# EAGLE schematic KickerBoard (EAGLE 7.4.0)
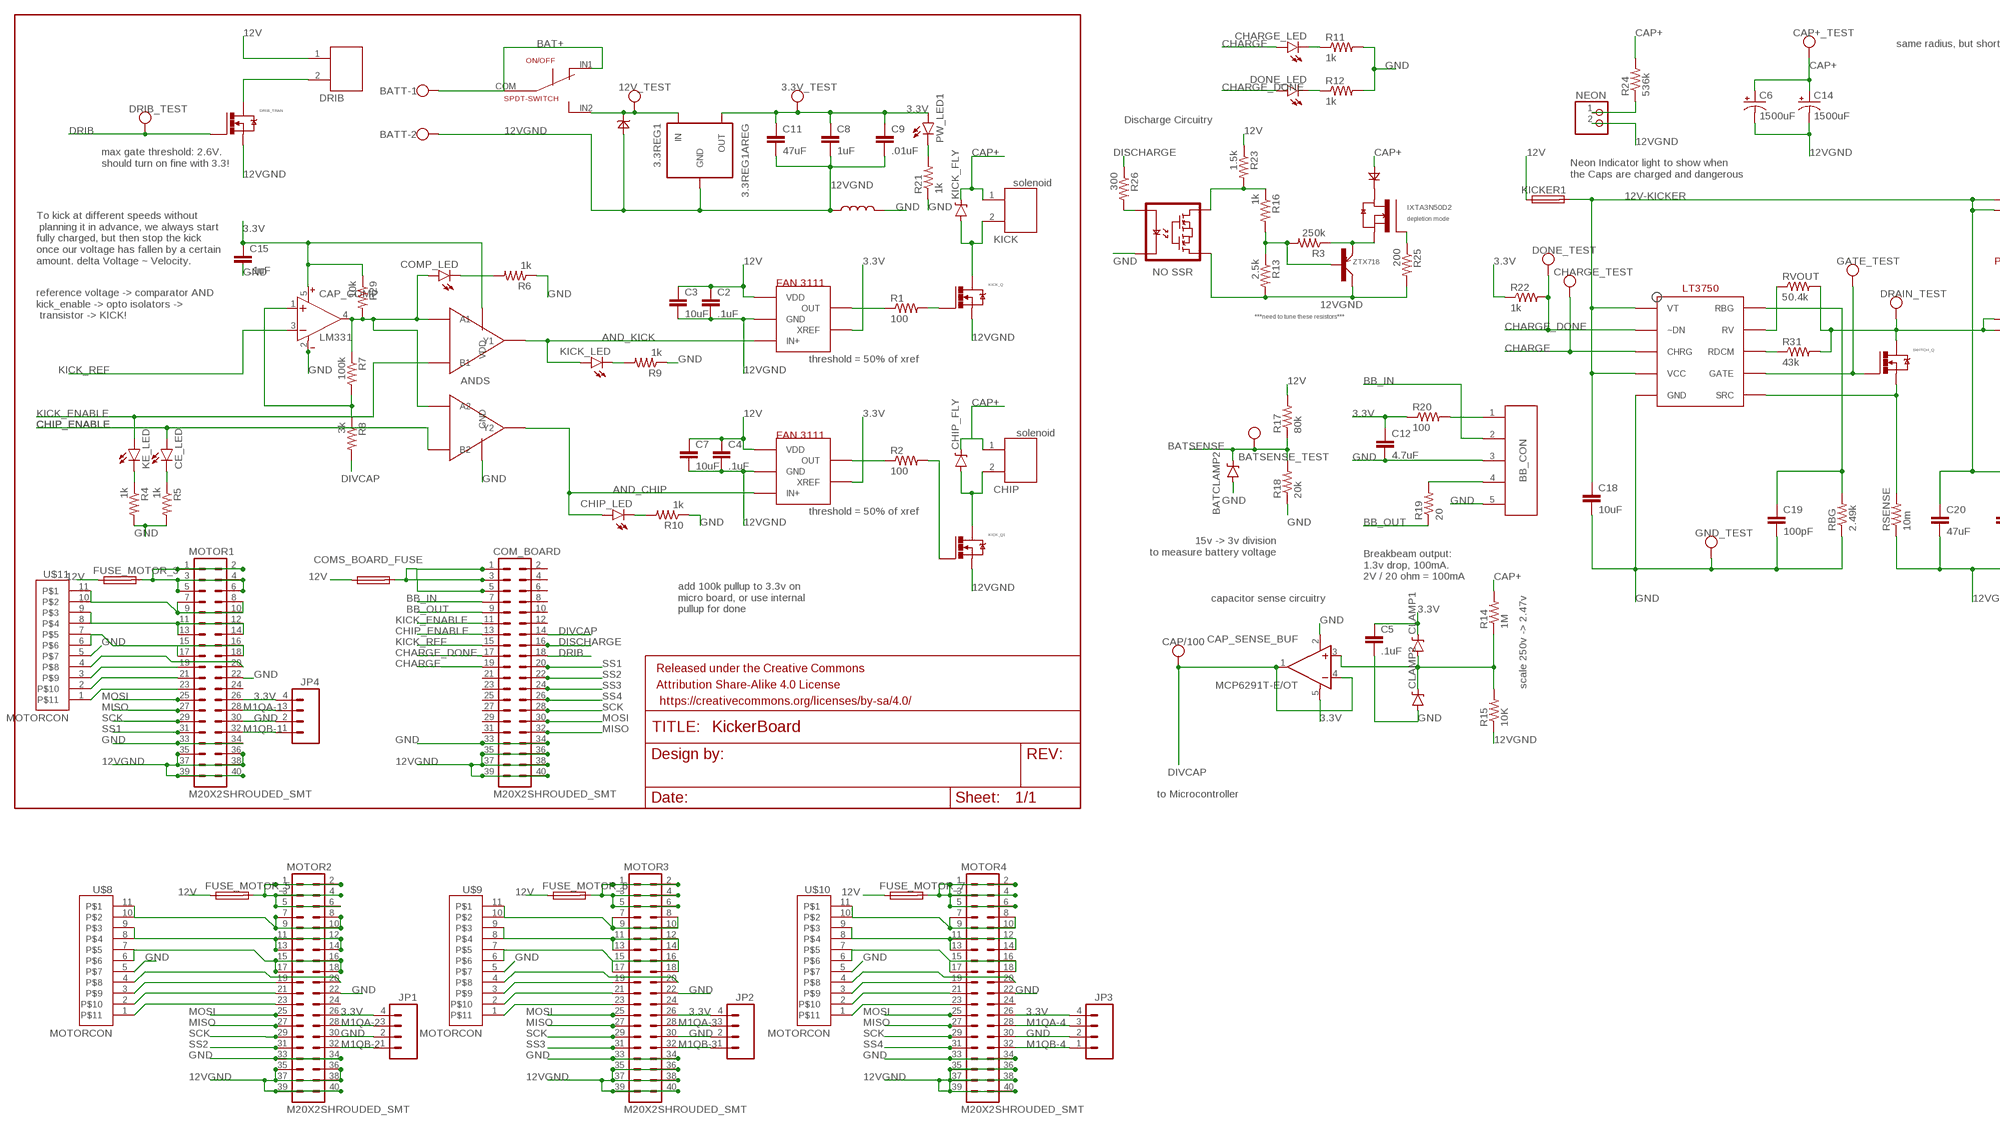
[diagram p0: schematic, sheet 1, part 1 of 3]
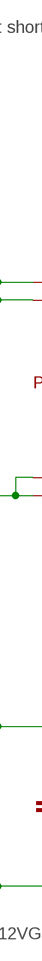
[diagram p1: schematic, sheet 1, part 2 of 3]
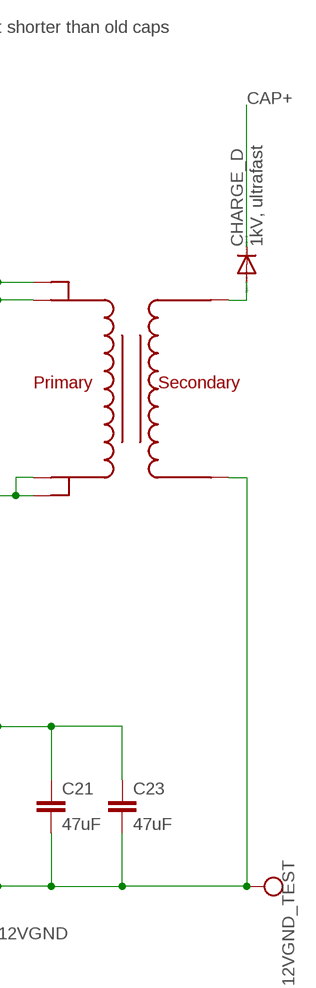
[diagram p2: schematic, sheet 1, part 3 of 3]

## Parts
3.3REG1  3.3REG1AREG  [DPAK]
3.3V_TEST  TEST_PT  [TESTING_PT]
12V_TEST  TEST_PT  [TESTING_PT]
12VGND_TEST  TEST_PT  [TESTING_PT]
ANDS  AND-DUAL  [TSSOP8]
BATCLAMP2  DIODE-ZENERDO214AC  [DO214AC]
BATSENSE_TEST  TEST_PT  [TESTING_PT]
BATT  W237-102  [W237-102]
BB_CON  JST-5  [JST-5-2MM]
C2  .1uF  CAP1206  [1206]
C3  10uF  CAP1206  [1206]
C4  .1uF  CAP1206  [1206]
C5  .1uF  CAP0805  [0805]
C6  1500uF  CPOL-USE10-35  [EB35D]
C7  10uF  CAP1206  [1206]
C8  1uF  CAP0805  [0805]
C9  .01uF  CAP0805  [0805]
C11  47uF  CAP1206  [1206]
C12  4.7uF  CAP0805  [0805]
C14  1500uF  CPOL-USE10-35  [EB35D]
C15  .1uF  CAP0805  [0805]
C18  10uF  CAP0805  [0805]
C19  100pF  CAP0805  [0805]
C20  47uF  CAP1206  [1206]
C21  47uF  CAP1206  [1206]
C23  47uF  CAP1206  [1206]
CAP+_TEST  TEST_PT  [TESTING_PT]
CAP/100  TEST_PT  [TESTING_PT]
CAP_COMP  LM331  [SOT23-5]
CAP_SENSE_BUF  MCP6291T-E/OT  [SOT23-5]
CE_LED  LED1206  [LED-1206]
CHARGE_D  1kV, ultrafast  DIODE-DO214AC  [DO214AC]
CHARGE_LED  LED1206  [LED-1206]
CHARGE_TEST  TEST_PT  [TESTING_PT]
CHARGE_U  LT3750  [10-MSOP]
CHIP  JST-22MM  [JST-2-2MM]
CHIP_FLY  DIODE-ZENERDO214AB  [DO214AB]
CHIP_LED  LED1206  [LED-1206]
CLAMP1  DIODE-ZENERDO214AC  [DO214AC]
CLAMP2  DIODE-ZENERDO214AC  [DO214AC]
COM_BOARD  M20X2SHROUDED_SMT  [2X20_SHROUDED_SMT]
COMP_LED  LED1206  [LED-1206]
COMS_BOARD_FUSE  TR5  [TR5]
DONE_LED  LED1206  [LED-1206]
DONE_TEST  TEST_PT  [TESTING_PT]
DRAIN_TEST  TEST_PT  [TESTING_PT]
DRIB  JST-22MM  [JST-2-2MM]
DRIB_TEST  TEST_PT  [TESTING_PT]
DRIB_TRAN  N-MOSFETDPAK  [DPAK]
FRAME4  FRAME-LETTER  [CREATIVE_COMMONS]
FUSE_MOTOR_3  TR5  [TR5]
FUSE_MOTOR_5  TR5  [TR5]
FUSE_MOTOR_6  TR5  [TR5]
FUSE_MOTOR_7  TR5  [TR5]
GATE_TEST  TEST_PT  [TESTING_PT]
GND_TEST  TEST_PT  [TESTING_PT]
JP1  M04SMD_RA_FEMALE  [1X04_SMD_RA_FEMALE]
JP2  M04SMD_RA_FEMALE  [1X04_SMD_RA_FEMALE]
JP3  M04SMD_RA_FEMALE  [1X04_SMD_RA_FEMALE]
JP4  M04SMD_RA_FEMALE  [1X04_SMD_RA_FEMALE]
KE_LED  LED1206  [LED-1206]
KICK  JST-22MM  [JST-2-2MM]
KICK_FLY  DIODE-ZENERDO214AB  [DO214AB]
KICK_LED  LED1206  [LED-1206]
KICK_Q  N-MOSFETDPAK  [DPAK]
KICK_Q1  N-MOSFETDPAK  [DPAK]
KICKER1  TR5  [TR5]
MOTOR1  M20X2SHROUDED_SMT  [2X20_SHROUDED_SMT]
MOTOR2  M20X2SHROUDED_SMT  [2X20_SHROUDED_SMT]
MOTOR3  M20X2SHROUDED_SMT  [2X20_SHROUDED_SMT]
MOTOR4  M20X2SHROUDED_SMT  [2X20_SHROUDED_SMT]
NEON  PINHD-1X2  [1X02]
ON/OFF  SPDT-SWITCH  [CK_SWITCH]
PW_LED1  LED1206  [LED-1206]
R1  100  RESISTOR0805-RES  [0805]
R2  100  RESISTOR0805-RES  [0805]
R3  250k  RESISTOR0805-RES  [0805]
R4  1k  RESISTOR0805-RES  [0805]
R5  1k  RESISTOR0805-RES  [0805]
R6  1k  RESISTOR0805-RES  [0805]
R7  100k  RESISTOR0805-RES  [0805]
R8  3k  RESISTOR0805-RES  [0805]
R9  1k  RESISTOR0805-RES  [0805]
R10  1k  RESISTOR0805-RES  [0805]
R11  1k  RESISTOR0805-RES  [0805]
R12  1k  RESISTOR0805-RES  [0805]
R13  2.5k  RESISTOR0805-RES  [0805]
R14  1M  RESISTOR0805-RES  [0805]
R15  10K  RESISTOR0805-RES  [0805]
R16  1k  RESISTOR0805-RES  [0805]
R17  80k  RESISTOR0805-RES  [0805]
R18  20k  RESISTOR0805-RES  [0805]
R19  20  RESISTOR0805-RES  [0805]
R20  100  RESISTOR0805-RES  [0805]
R21  1k  RESISTOR0805-RES  [0805]
R22  1k  RESISTOR0805-RES  [0805]
R23  1.5k  RESISTOR0805-RES  [0805]
R24  536k  RESISTOR0805-RES  [0805]
R25  200  RESISTOR0805-RES  [0805]
R26  300  RESISTOR0805-RES  [0805]
R29  10k  RESISTOR0805-RES  [0805]
R31  43k  RESISTOR0805-RES  [0805]
RBG  2.49k  RESISTOR0805-RES  [0805]
RSENSE  10m  RESISTOR2512  [R2512]
RVOUT  50.4k  RESISTOR0805-RES  [0805]
SWITCH_Q  N-MOSFETDPAK  [DPAK]
U$1  FAN31111  [SOT23-5]
U$2  IXTA3N50D2  [TO-263]
U$3  32052-TRANSFORMER  [10-TRANSFORMER]
U$4  FAN31111  [SOT23-5]
U$5  VO1400AEFTR  [SOP4]
U$6  ZTX718  [TO92]
U$7  1N4007  [THROUGH-HOLE-2]
U$8  MOTORCON  [GEN3CON]
U$9  MOTORCON  [GEN3CON]
U$10  MOTORCON  [GEN3CON]
U$11  MOTORCON  [GEN3CON]
U$12  13VZENER  [THROUGH-HOLE-2]
U$13  INDUCTOR  [0805]

## Nets
3.3V: 3.3REG1.SOURCE(OUT) 3.3V_TEST.P$1 ANDS.P$8(VDD) C5.1 C8.1 C9.1 C11.1 C12.1 C15.1 CAP_COMP.5(V+) CAP_SENSE_BUF.5(V+) CLAMP1.C JP1.4 JP2.4 JP3.4 JP4.4 MOTOR1.26 MOTOR2.26 MOTOR3.26 MOTOR4.26 PW_LED1.A R20.1 R22.1 R29.1 U$1.4(XREF) U$4.4(XREF)
12V: 3.3REG1.GATE(IN) 12V_TEST.P$1 C2.1 C3.1 C4.1 C7.1 COMS_BOARD_FUSE.1 DRIB.1 FUSE_MOTOR_3.1 FUSE_MOTOR_5.1 FUSE_MOTOR_6.1 FUSE_MOTOR_7.1 KICKER1.1 ON/OFF.IN2(P2) R17.2 R23.1 U$1.1(VDD) U$4.1(VDD) U$12.-
12V-KICKER: C18.1 C20.1 C21.1 C23.1 CHARGE_U.P$1(VT) CHARGE_U.P$4(VCC) KICKER1.2 U$3.P$4 U$3.P$5
12VGND: 3.3REG1.DRAIN(GND) 12VGND_TEST.P$1 BATT.2 C2.2 C3.2 C4.2 C6.- C7.2 C8.2 C9.2 C11.2 C14.- C20.2 C21.2 C23.2 COM_BOARD.35 COM_BOARD.36 COM_BOARD.37 COM_BOARD.38 COM_BOARD.39 COM_BOARD.40 DRIB_TRAN.SOURCE(S) KICK_Q1.SOURCE(S) KICK_Q.SOURCE(S) MOTOR1.35 MOTOR1.36 MOTOR1.37 MOTOR1.38 MOTOR1.39 MOTOR1.40 MOTOR2.35 MOTOR2.36 MOTOR2.37 MOTOR2.38 MOTOR2.39 MOTOR2.40 MOTOR3.35 MOTOR3.36 MOTOR3.37 MOTOR3.38 MOTOR3.39 MOTOR3.40 MOTOR4.35 MOTOR4.36 MOTOR4.37 MOTOR4.38 MOTOR4.39 MOTOR4.40 NEON.2 R13.2 R15.1 R25.2 RSENSE.1 U$1.2(GND) U$3.P$10 U$4.2(GND) U$5.3(S2) U$6.LEFT(COLLECTOR) U$12.+ U$13.1
AND_CHIP: ANDS.P$3(Y2) CHIP_LED.A U$1.3(IN+)
AND_KICK: ANDS.P$7(Y1) KICK_LED.A U$4.3(IN+)
BAT+: BATT.1 ON/OFF.COM ON/OFF.IN1(P1)
BATSENSE: BATCLAMP2.C BATSENSE_TEST.P$1 R17.1 R18.2
BB_IN: BB_CON.2 COM_BOARD.7
BB_OUT: COM_BOARD.9 R19.1
CAP+: C6.+ C14.+ CAP+_TEST.P$1 CHARGE_D.C CHIP.1 CHIP_FLY.CATHODE(C) KICK.1 KICK_FLY.CATHODE(C) R14.2 R24.2 U$7.+(D+)
CHARGE: CHARGE_LED.A CHARGE_TEST.P$1 CHARGE_U.P$3(CHRG) COM_BOARD.19
CHARGE_DONE: CHARGE_U.P$2(~DN) COM_BOARD.17 DONE_LED.A DONE_TEST.P$1 R22.2
CHIP_ENABLE: ANDS.P$6(B2) CE_LED.A COM_BOARD.13
COMP_OUT: ANDS.P$1(A1) ANDS.P$5(A2) CAP_COMP.4(OUT) COMP_LED.A R7.1 R29.2
DISCHARGE: COM_BOARD.16 R26.1
DIVCAP: CAP/100.P$1 CAP_SENSE_BUF.1(OUT) CAP_SENSE_BUF.4(-IN) COM_BOARD.14 R8.2
DRIB: COM_BOARD.18 DRIB_TEST.P$1 DRIB_TRAN.GATE(G)
GND: ANDS.P$4(GND) BATCLAMP2.A BB_CON.3 BB_CON.5 C5.2 C12.2 C15.2 C18.2 C19.2 CAP_COMP.2(V-) CAP_SENSE_BUF.2(V-) CHARGE_U.P$5(GND) CLAMP2.A COM_BOARD.33 COM_BOARD.34 GND_TEST.P$1 JP1.2 JP2.2 JP3.2 JP4.2 MOTOR1.22 MOTOR1.30 MOTOR1.33 MOTOR1.34 MOTOR2.22 MOTOR2.30 MOTOR2.33 MOTOR2.34 MOTOR3.22 MOTOR3.30 MOTOR3.33 MOTOR3.34 MOTOR4.22 MOTOR4.30 MOTOR4.33 MOTOR4.34 R4.2 R5.2 R6.1 R9.1 R10.1 R11.2 R12.2 R18.1 R21.1 RBG.1 U$5.2(LED-) U$8.5 U$9.5 U$10.5 U$11.5 U$13.2
HYSTERESIS: CAP_COMP.1(IN+) R7.2 R8.1
KICK_ENABLE: ANDS.P$2(B1) COM_BOARD.11 KE_LED.A
KICK_REF: CAP_COMP.3(IN-) COM_BOARD.15
LOWCHIP: CHIP.2 CHIP_FLY.ANODE(A) KICK_Q1.DRAIN(D)
LOWKICK: KICK.2 KICK_FLY.ANODE(A) KICK_Q.DRAIN(D)
M1QA-1: JP4.3 MOTOR1.28
M1QA-2: JP1.3 MOTOR2.28
M1QA-3: JP2.3 MOTOR3.28
M1QA-4: JP3.3 MOTOR4.28
M1QB-1: JP4.1 MOTOR1.32
M1QB-2: JP1.1 MOTOR2.32
M1QB-3: JP2.1 MOTOR3.32
M1QB-4: JP3.1 MOTOR4.32
MISO: COM_BOARD.32 MOTOR1.27 MOTOR2.27 MOTOR3.27 MOTOR4.27
MOSI: COM_BOARD.30 MOTOR1.25 MOTOR2.25 MOTOR3.25 MOTOR4.25
N$1: DRAIN_TEST.P$1 R31.2 RVOUT.2 SWITCH_Q.DRAIN(D) U$3.P$6 U$3.P$7
N$2: R1.1 U$4.5(OUT)
N$3: KICK_Q1.GATE(G) R2.2
N$4: FUSE_MOTOR_6.2 MOTOR3.1 MOTOR3.2 MOTOR3.3 MOTOR3.4 MOTOR3.5 MOTOR3.6
N$5: R2.1 U$1.5(OUT)
N$6: CHARGE_U.P$8(RDCM) R31.1
N$7: C19.1 CHARGE_U.P$10(RBG) RBG.2
N$8: KICK_Q.GATE(G) R1.2
N$9: CHARGE_U.P$7(GATE) GATE_TEST.P$1 SWITCH_Q.GATE(G)
N$10: R3.1 U$2.LOWER_RIGHT(SOURCE) U$6.RIGHT(EMITTER)
N$11: KE_LED.C R4.1
N$12: CHARGE_U.P$9(RV) RVOUT.1
N$13: CE_LED.C R5.1
N$14: COMP_LED.C R6.2
N$15: KICK_LED.C R9.2
N$17: CHIP_LED.C R10.2
N$18: R3.2 R13.1 R16.2 U$6.CENTER(BASE)
N$19: DONE_LED.C R12.1
N$20: CHARGE_LED.C R11.1
N$21: R25.1 U$2.LOWER_LEFT(GATE)
N$23: PW_LED1.C R21.2
N$24: CHARGE_U.P$6(SRC) RSENSE.2 SWITCH_Q.SOURCE(S)
N$25: FUSE_MOTOR_7.2 MOTOR4.1 MOTOR4.2 MOTOR4.3 MOTOR4.4 MOTOR4.5 MOTOR4.6
N$26: FUSE_MOTOR_5.2 MOTOR2.1 MOTOR2.2 MOTOR2.3 MOTOR2.4 MOTOR2.5 MOTOR2.6
N$27: FUSE_MOTOR_3.2 MOTOR1.1 MOTOR1.2 MOTOR1.3 MOTOR1.4 MOTOR1.5 MOTOR1.6
N$28: COM_BOARD.1 COM_BOARD.3 COM_BOARD.5 COMS_BOARD_FUSE.2
N$29: R16.1 R23.2 U$5.4(S1)
N$30: R26.2 U$5.1(LED+)
N$32: BB_CON.4 R19.2
N$36: U$2.TAB(DRAIN) U$7.-(D-)
N$37: MOTOR2.7 MOTOR2.8 MOTOR2.9 MOTOR2.10 U$8.10 U$8.11
N$38: MOTOR2.11 MOTOR2.12 MOTOR2.13 MOTOR2.14 U$8.8 U$8.9
N$39: MOTOR2.15 MOTOR2.16 MOTOR2.17 MOTOR2.18 U$8.6 U$8.7
N$40: BB_CON.1 R20.2
N$42: MOTOR2.20 U$8.4
N$43: MOTOR2.19 U$8.3
N$44: MOTOR2.21 U$8.2
N$45: MOTOR2.23 U$8.1
N$46: MOTOR1.7 MOTOR1.8 MOTOR1.9 MOTOR1.10 U$11.10 U$11.11
N$47: MOTOR1.11 MOTOR1.12 MOTOR1.13 MOTOR1.14 U$11.8 U$11.9
N$48: MOTOR1.15 MOTOR1.16 MOTOR1.17 MOTOR1.18 U$11.6 U$11.7
N$50: MOTOR1.20 U$11.4
N$51: MOTOR1.19 U$11.3
N$52: MOTOR1.21 U$11.2
N$53: MOTOR1.23 U$11.1
N$54: MOTOR3.7 MOTOR3.8 MOTOR3.9 MOTOR3.10 U$9.10 U$9.11
N$55: MOTOR3.11 MOTOR3.12 MOTOR3.13 MOTOR3.14 U$9.8 U$9.9
N$56: MOTOR3.15 MOTOR3.16 MOTOR3.17 MOTOR3.18 U$9.6 U$9.7
N$58: MOTOR3.20 U$9.4
N$59: MOTOR3.19 U$9.3
N$60: MOTOR3.21 U$9.2
N$61: MOTOR3.23 U$9.1
N$62: MOTOR4.7 MOTOR4.8 MOTOR4.9 MOTOR4.10 U$10.10 U$10.11
N$63: MOTOR4.11 MOTOR4.12 MOTOR4.13 MOTOR4.14 U$10.8 U$10.9
N$64: MOTOR4.15 MOTOR4.16 MOTOR4.17 MOTOR4.18 U$10.6 U$10.7
N$66: MOTOR4.20 U$10.4
N$67: MOTOR4.19 U$10.3
N$68: MOTOR4.21 U$10.2
N$69: MOTOR4.23 U$10.1
SCK: COM_BOARD.28 MOTOR1.29 MOTOR2.29 MOTOR3.29 MOTOR4.29
SS1: COM_BOARD.20 MOTOR1.31
SS2: COM_BOARD.22 MOTOR2.31
SS3: COM_BOARD.24 MOTOR3.31
SS4: COM_BOARD.26 MOTOR4.31
TO_DRIB: DRIB.2 DRIB_TRAN.DRAIN(D)
TO_NEON: NEON.1 R24.1
TRANS_OUT: CHARGE_D.A U$3.P$1
UNBUF_DIVCAP: CAP_SENSE_BUF.3(+IN) CLAMP1.A CLAMP2.C R14.1 R15.2
Unconnected: COM_BOARD.2 COM_BOARD.4 COM_BOARD.6 COM_BOARD.8 COM_BOARD.10 COM_BOARD.12 COM_BOARD.21 COM_BOARD.23 COM_BOARD.25 COM_BOARD.27 COM_BOARD.29 COM_BOARD.31 MOTOR1.24 MOTOR2.24 MOTOR3.24 MOTOR4.24

## Notes on the sheet
- same radius, but shorter than old caps
- Discharge Circuitry
- DISCHARGE
- max gate threshold: 2.6V. 
  should turn on fine with 3.3!
- Neon Indicator light to show when
  the Caps are charged and dangerous
- solenoid
- IXTA3N50D2
- depletion mode
- To kick at different speeds without
   planning it in advance, we always start 
  fully charged, but then stop the kick 
  once our voltage has fallen by a certain 
  amount. delta Voltage ~ Velocity.
- ZTX718
- NO SSR
- reference voltage -> comparator AND 
  kick_enable -> opto isolators ->
   transistor -> KICK!
- ***need to tune these resistors***
- threshold = 50% of xref
- solenoid
- threshold = 50% of xref
- 15v -> 3v division
  to measure battery voltage
- Breakbeam output:
  1.3v drop, 100mA.
  2V / 20 ohm = 100mA
- capacitor sense circuitry
- add 100k pullup to 3.3v on 
  micro board, or use internal 
  pullup for done
- DISCHARGE
- scale 250v -> 2.47v
- to Microcontroller

## Library data of the parts
3.3REG1 = gen3:3.3REG1A
3.3V_TEST 12V_TEST 12VGND_TEST BATSENSE_TEST CAP+_TEST CAP/100 CHARGE_TEST DONE_TEST DRAIN_TEST DRIB_TEST GATE_TEST GND_TEST = gen3:TEST_PT: Testing Point Use to probe a signal
ANDS = gen3:AND-DUAL
BATCLAMP2 CHIP_FLY CLAMP1 CLAMP2 KICK_FLY = gen3:DIODE-ZENER: Zener Diode Production Part - 8199 3.4V Zener Voltage
BATT = con-wago-500:W237-102: WAGO SCREW CLAMP; MPN: 237-102; OC_FARNELL: unknown; OC_NEWARK: 70K9898
BB_CON = gen3:JST-5
C2-C5 C7-C9 C11 C12 C15 C18-C21 C23 = SparkFun-Capacitors:CAP: Capacitor Standard 0603 ceramic capacitor, and 0.1" leaded capacitor.
C6 C14 = rcl:CPOL-US: POLARIZED CAPACITOR, American symbol
CAP_COMP = gen3:LM331: LM331 Single Comparator Digikey: 296-6633-1-ND
CAP_SENSE_BUF = SparkFun-AnalogIC:MCP6291: Rail to rail OpAmp with 10MHz GBP; PROD_ID: IC-11991
CE_LED CHARGE_LED CHIP_LED COMP_LED DONE_LED KE_LED KICK_LED PW_LED1 = SparkFun-LED:LED: LEDs Standard schematic elements and footprints for 5mm, 3mm, 1206, and 0603 sized LEDs. 5mm - Spark Fun Electronics SKU : COM-00529 (and others)
CHARGE_D = gen3:DIODE-: DIODE
CHARGE_U = kickerchips:LT3750
CHIP DRIB KICK = gen3:JST-2
COM_BOARD MOTOR1-MOTOR4 = SparkFun-Connectors:M20X2: 0.1" spaced headers
COMS_BOARD_FUSE FUSE_MOTOR_3 FUSE_MOTOR_5-FUSE_MOTOR_7 KICKER1 = fuse:TR5: FUSE Wickmann; OC_FARNELL: unknown; OC_NEWARK: unknown
DRIB_TRAN KICK_Q KICK_Q1 SWITCH_Q = gen3:N-MOSFET: N-Channel Power Mosfet
FRAME4 = SparkFun-Aesthetics:FRAME-LETTER: Schematic Frame Standard 8.5x11 US Letter frame
JP1-JP4 = SparkFun-Connectors:M04: Header 4 Standard 4-pin 0.1" header. Use with straight break away headers (SKU : PRT-00116), right angle break away headers (PRT-00553), swiss pins (PRT-00743), machine pins (PRT-00117), and female headers (PRT-00115). Molex polarized connector foot print use with SKU : PRT-08231 with associated crimp pins and housings. 1MM SMD Version SKU: PRT-10208
NEON = pinhead:PINHD-1X2: PIN HEADER
ON/OFF = gen3:SPDT-SWITCH
R1 R2 R14 R15 = SparkFun-Resistors:RESISTOR: Resistor Basic schematic elements and footprints for 0603, 1206, and PTH resistors.
R3-R13 R16-R26 R29 R31 RBG RSENSE RVOUT = SparkFun-Passives:RESISTOR: Resistor Basic schematic elements and footprints for 0603, 1206, and PTH resistors.
U$1 U$4 = kickerchips:FAN3111: FAN3111 Low Side Gate Driver, 1A. switches at 50% of xref
U$2 = rfc:IXTA3N50D2
U$3 = gen3:32052-TRANSFORMER: 32052 flyback transformer digikey #: 732-2129-1-ND
U$5 = rfc:VO1400AEFTR
U$6 = rfc:ZTX718
U$7 = rfc:1N4007
U$8-U$11 = gen3:MOTORCON: Motor Connector bottom side connector for ribbon cable
U$12 = rfc:13VZENER
U$13 = gen3:INDUCTOR